# Altium schematic sheet MCU.SchDoc
size A4; PageSetup: Record=PageOptions|CenterHorizontal=True|CenterVertical=True|PrintScale=0.97|XCorrection=1.00|YCorrection=1.00|PrintKind=0|BorderSize=5000000|LeftOffset=0|BottomOffset=0|Orientation=2|PaperLength=1000|PaperWidth=1000|Scale=100|PaperSource=7|PrintQuality=-4|MediaType=1|DitherType=10|PaperKind=A4|PrintScaleMode=1
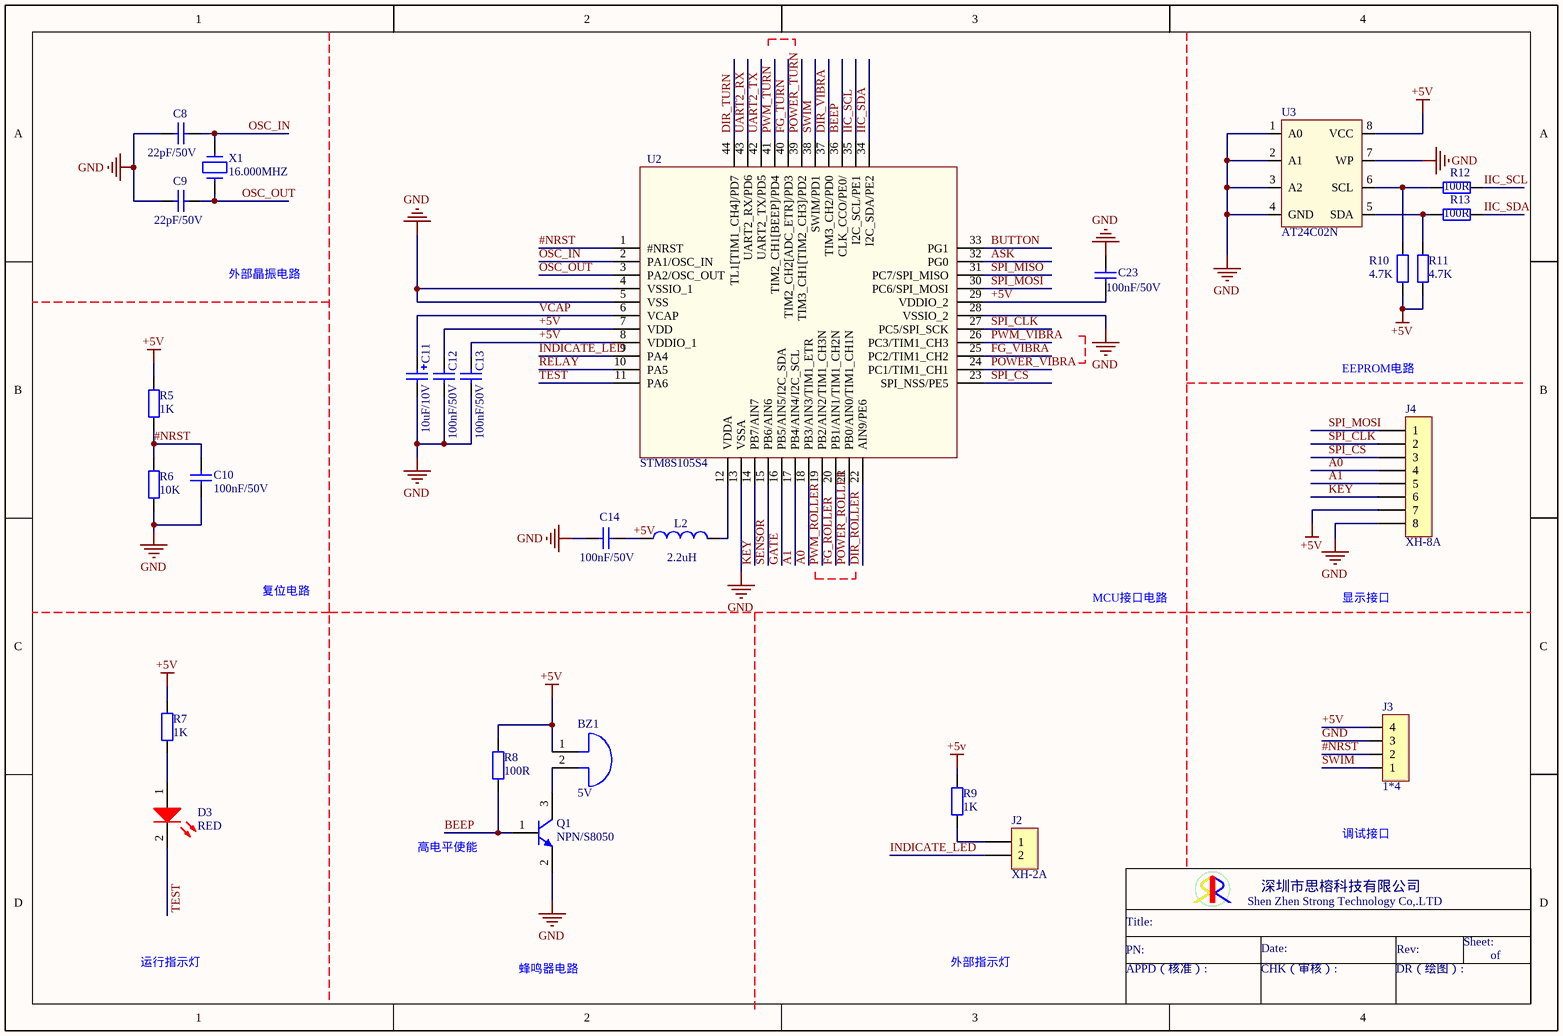
[diagram p0: MCU.SchDoc]

## Parts
BZ1  5V  [BUZZER]
C8  22pF/50V  [0603C]
C9  22pF/50V  [0603C]
C10  100nF/50V  [0603C]
C11  10uF/10V  [3216]
C12  100nF/50V  [0603C]
C13  100nF/50V  [0603C]
C14  100nF/50V  [0603C]
C23  100nF/50V  [0603C]
D3  RED  [0603D]
J2  XH-2A  [CN2-2.54]
J3  1*4  [SIP4-2.54mm]
J4  XH-8A  [PH2.0MM-8PIN]
L2  2.2uH  [0805L]
Q1  NPN/S8050  [SOT-23]
R5  1K  [0603R]
R6  10K  [0603R]
R7  1K  [0603R]
R8  100R  [0603R]
R9  1K  [0603R]
R10  4.7K  [0603R]
R11  4.7K  [0603R]
R12  100R  [0603R]
R13  100R  [0603R]
U2  STM8S105S4  [LQFP44]
U3  AT24C02N  [SOP8]
X1  16.000MHZ  [CRYL3*5]

## Nets
+5V: BZ1.1 C12.2 C13.2 C14.2 C23.1 J3.4 J4.7 L2.1 R5.2 R7.1 R8.2 R9.2 R10.1 R11.1 U2.7(VDD) U2.8(VDDIO_1) U2.29(VDDIO_2) U3.8(VCC)
GND: C8.2 C9.2 C10.1 C11.2 C12.1 C13.1 C14.1 C23.2 J3.3 J4.8 Q1.2(E) R6.1 U2.4(VSSIO_1) U2.5(VSS) U2.13(VSSA) U2.28(VSSIO_2) U3.1(A0) U3.2(A1) U3.3(A2) U3.4(GND) U3.7(WP)
#NRST: C10.2 J3.2 R5.1 R6.2 U2.1(#NRST)
A0: J4.4 U2.18(PB3/AIN3/TIM1_ETR)
A1: J4.5 U2.17(PB4/AIN4/I2C_SCL)
ASK: U2.32(PG0)
BEEP: Q1.1(B) R8.1 U2.36(CLK_CCO/PE0/)
BUTTON: U2.33(PG1)
DIR_ROLLER: U2.22(AIN9/PE6)
DIR_TURN: U2.44(TL1[TIM1_CH4]/PD7)
DIR_VIBRA: U2.37(TIM3_CH2/PD0)
FG_ROLLER: U2.20(PB1/AIN1/TIM1_CH2N)
FG_TURN: U2.40(TIM2_CH2[ADC_ETR]/PD3)
FG_VIBRA: U2.25(PC2/TIM1_CH2)
GATE: U2.16(PB5/AIN5/I2C_SDA)
IIC_SCL: R12.2 U2.35(I2C_SCL/PE1)
IIC_SDA: R13.2 U2.34(I2C_SDA/PE2)
INDICATE_LED: J2.2 U2.9(PA4)
KEY: J4.6 U2.14(PB7/AIN7)
OSC_IN: C8.1 U2.2(PA1/OSC_IN) X1.2
OSC_OUT: C9.1 U2.3(PA2/OSC_OUT) X1.1
POWER_ROLLER: U2.21(PB0/AIN0/TIM1_CH1N)
POWER_TURN: U2.39(TIM3_CH1[TIM2_CH3]/PD2)
POWER_VIBRA: U2.24(PC1/TIM1_CH1)
PWM_ROLLER: U2.19(PB2/AIN2/TIM1_CH3N)
PWM_TURN: U2.41(TIM2_CH1[BEEP]/PD4)
PWM_VIBRA: U2.26(PC3/TIM1_CH3)
RELAY: U2.10(PA5)
SENSOR: U2.15(PB6/AIN6)
SPI_CLK: J4.2 U2.27(PC5/SPI_SCK)
SPI_CS: J4.3 U2.23(SPI_NSS/PE5)
SPI_MISO: U2.31(PC7/SPI_MISO)
SPI_MOSI: J4.1 U2.30(PC6/SPI_MOSI)
SWIM: J3.1 U2.38(SWIM/PD1)
TEST: D3.2 U2.11(PA6)
UART2_RX: U2.43(UART2_RX/PD6)
UART2_TX: U2.42(UART2_TX/PD5)
VCAP: C11.1 U2.6(VCAP)
NetBZ1_2: BZ1.2 Q1.3(C)
NetD3_1: D3.1 R7.2
NetJ2_1: J2.1 R9.1
NetL2_2: L2.2 U2.12(VDDA)
NetR10_2: R10.2 R12.1 U3.6(SCL)
NetR11_2: R11.2 R13.1 U3.5(SDA)

## Notes on the sheet
- 外部晶振电路
- EEPROM电路
- 复位电路
- MCU接口电路
- 显示接口
- 高电平使能
- 调试接口
- 运行指示灯
- 蜂鸣器电路
- 外部指示灯
- Shen Zhen Strong Technology Co,.LTD
- 深圳市思榕科技有限公司
- Title:
- PN:
- APPD（核准）:
- Date:
- CHK（审核）:
- DR（绘图）:
- Rev:
- Sheet:
- of

## Library data of the parts
BZ1 = BEEP-5V: Ф11.8*9.5，DC5V; 料号: 11302-00002-00; 品名: 蜂鸣器
C8 C9 = C22pF/50V-0603: 瓷片电容,22pF,5%,X7R,50V,0603; 料号: 10201-02202-00; 品名: 瓷片电容
C10 C12-C14 C23 = C100nF/50V-0603: 瓷片电容,100nF,5%,X7R,50V,0603; 料号: 10201-10032-00; 品名: 瓷片电容
C11 = C10uF/10V-A: 钽电容,10uF,10%,10V,3216(A); 料号: 10203-10053-00; 品名: 钽电容
D3 = LED-RED-0603: LED，红光，0603; 料号: 10406-00008-00; 品名: 发光二极管
J2 = CONN-XH-2A: CONN,XH-2A,2PIN,2.54mm插座; 料号: 10701-00001-00; 品名: 线对板连接器
J3 = SIP1*4-FM: 单排母，1*4,2.54mm; 料号: 10701-00084-00; 品名: 线对板连接器
J4 = CONN-XH-8A: CONN,XH-8A,8PIN,2.54mm插座; 料号: 10701-00016-00; 品名: 线对板连接器
L2 = L2.2uH-0805: 磁珠,2.2uH,0805; 料号: 10302-2U203-00; 品名: 磁珠
Q1 = S8050: NPN型三极管，S8050，SOT－23; 料号: 10501-00001-00; 品名: NPN型三极管
R5 R7 R9 = R1K-0603: 金属膜电阻,1K,1%,1/10W,0603; 料号: 10101-10012-00; 品名: 金属膜电阻
R6 = R10K-0603: 金属膜电阻,10K,1%,1/10W,0603; 料号: 10101-10022-00; 品名: 金属膜电阻
R8 R12 R13 = R100R-0603: 金属膜电阻,100R,1%,1/10W,0603; 料号: 10101-10002-00; 品名: 金属膜电阻
R10 R11 = R4.7K-0603: 金属膜电阻,4.7K,1%,1/10W,0603; 料号: 10101-47012-00; 品名: 金属膜电阻
U2 = STM8S105S4: MCU，STM8S105S4，LQFP44; 料号: 10601-00045-3H; 品名: MCU
U3 = AT24C02N: IC，AT24C02N，SOP8; 料号: 10603-00003-5H; 品名: 存储器
X1 = CRYSTAL: 无源晶振，16.000MHZ，贴片2脚，5.0*3.2*1.2; 品名: 无源晶振